# EAGLE schematic anemometer (EAGLE 6.4)
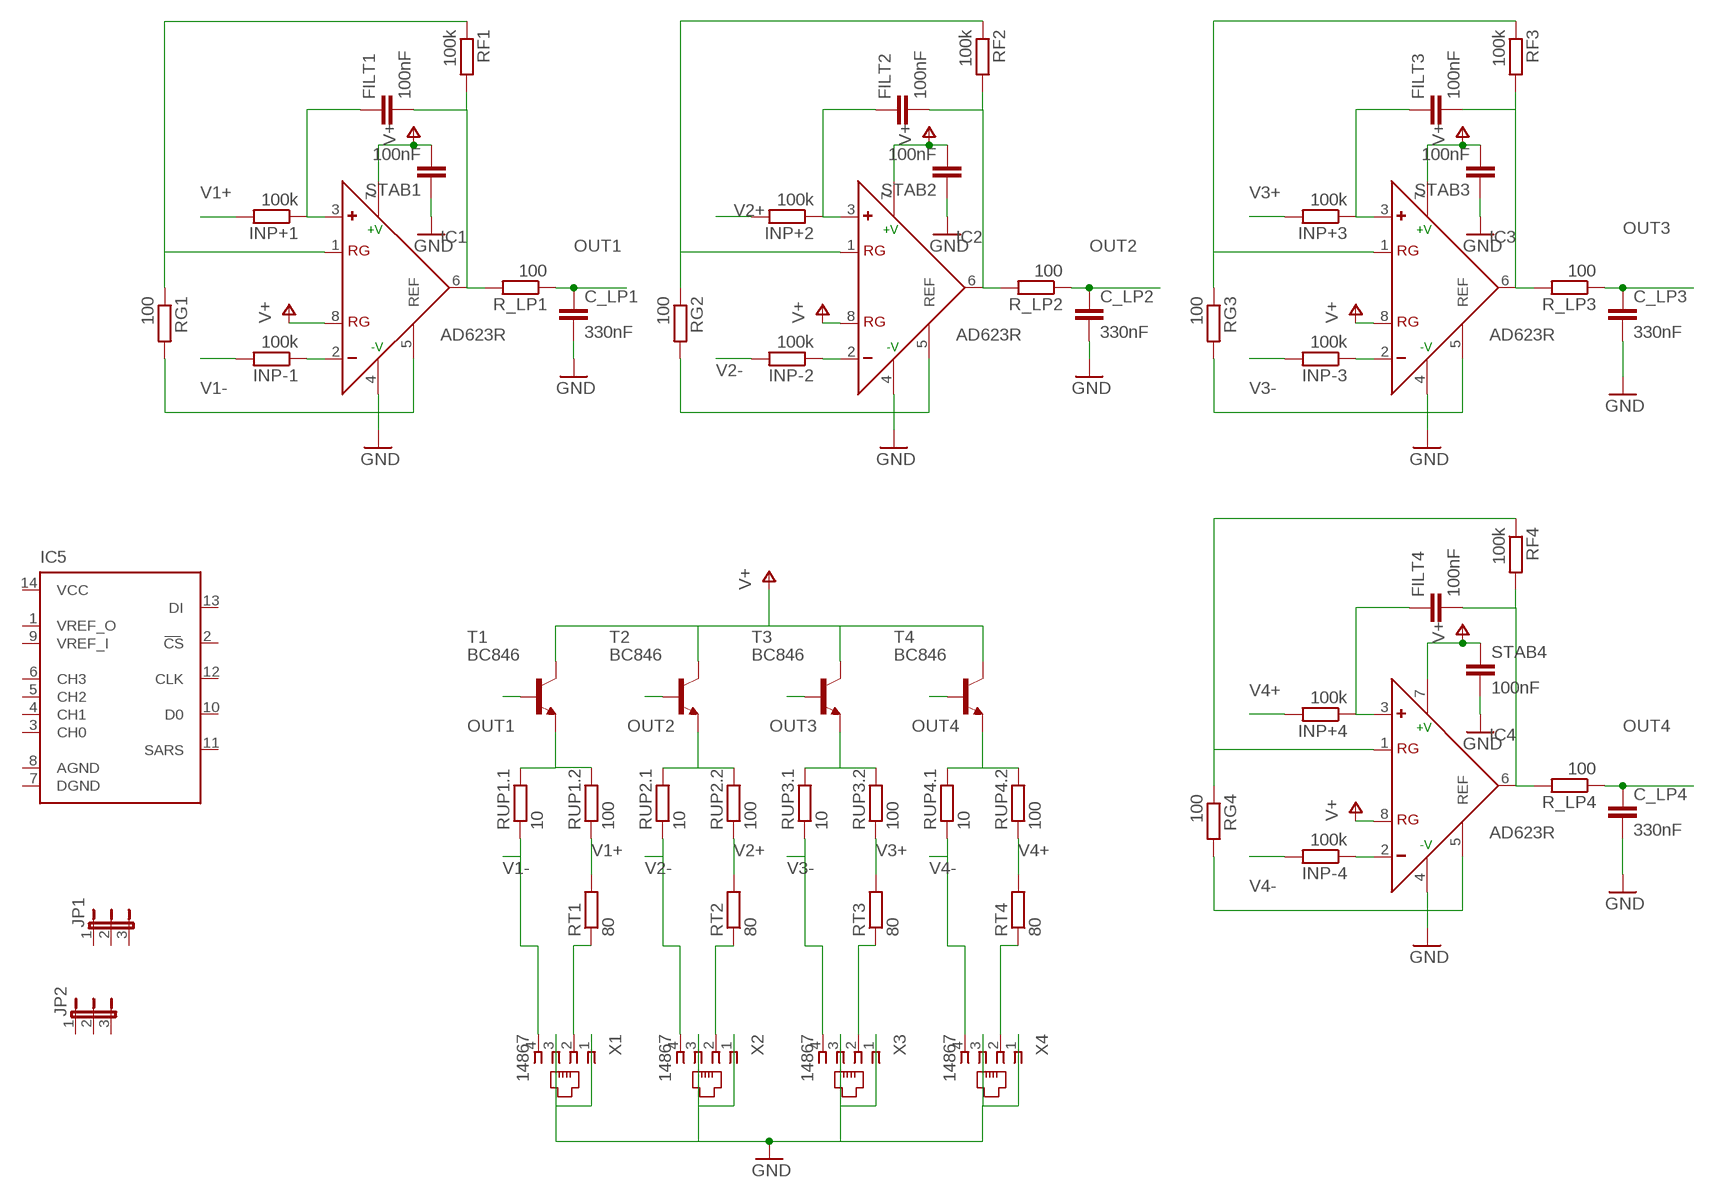
[diagram p0: schematic, sheet 1]

## Parts
C_LP1  330nF  C-EUC1206  [C1206]
C_LP2  330nF  C-EUC1206  [C1206]
C_LP3  330nF  C-EUC1206  [C1206]
C_LP4  330nF  C-EUC1206  [C1206]
FILT1  100nF  C-EUC1206  [C1206]
FILT2  100nF  C-EUC1206  [C1206]
FILT3  100nF  C-EUC1206  [C1206]
FILT4  100nF  C-EUC1206  [C1206]
IC1  AD623R  [SO8]
IC2  AD623R  [SO8]
IC3  AD623R  [SO8]
IC4  AD623R  [SO8]
IC5  ADC08034D  [SO14]
INP+1  100k  R-EU_M1206  [M1206]
INP+2  100k  R-EU_M1206  [M1206]
INP+3  100k  R-EU_M1206  [M1206]
INP+4  100k  R-EU_M1206  [M1206]
INP-1  100k  R-EU_M1206  [M1206]
INP-2  100k  R-EU_M1206  [M1206]
INP-3  100k  R-EU_M1206  [M1206]
INP-4  100k  R-EU_M1206  [M1206]
JP1  JP2E  [JP2]
JP2  JP2E  [JP2]
R_LP1  100  R-EU_M1206  [M1206]
R_LP2  100  R-EU_M1206  [M1206]
R_LP3  100  R-EU_M1206  [M1206]
R_LP4  100  R-EU_M1206  [M1206]
RF1  100k  R-EU_M1206  [M1206]
RF2  100k  R-EU_M1206  [M1206]
RF3  100k  R-EU_M1206  [M1206]
RF4  100k  R-EU_M1206  [M1206]
RG1  100  R-EU_M1206  [M1206]
RG2  100  R-EU_M1206  [M1206]
RG3  100  R-EU_M1206  [M1206]
RG4  100  R-EU_M1206  [M1206]
RT1  80  R-EU_R1206  [R1206]
RT2  80  R-EU_R1206  [R1206]
RT3  80  R-EU_R1206  [R1206]
RT4  80  R-EU_R1206  [R1206]
RUP1.1  10  R-EU_R1206  [R1206]
RUP1.2  100  R-EU_R1206  [R1206]
RUP2.1  10  R-EU_R1206  [R1206]
RUP2.2  100  R-EU_R1206  [R1206]
RUP3.1  10  R-EU_R1206  [R1206]
RUP3.2  100  R-EU_R1206  [R1206]
RUP4.1  10  R-EU_R1206  [R1206]
RUP4.2  100  R-EU_R1206  [R1206]
STAB1  100nF  C-EUC1206  [C1206]
STAB2  100nF  C-EUC1206  [C1206]
STAB3  100nF  C-EUC1206  [C1206]
STAB4  100nF  C-EUC1206  [C1206]
T1  BC846  [SOT23]
T2  BC846  [SOT23]
T3  BC846  [SOT23]
T4  BC846  [SOT23]
X1  14867  [14867]
X2  14867  [14867]
X3  14867  [14867]
X4  14867  [14867]

## Nets
GND: C_LP1.2 C_LP2.2 C_LP3.2 C_LP4.2 IC1.4(-V) IC1.5(REF) IC2.4(-V) IC2.5(REF) IC3.4(-V) IC3.5(REF) IC4.4(-V) IC4.5(REF) RG1.2 RG2.2 RG3.2 RG4.2 STAB1.1 STAB2.1 STAB3.1 STAB4.2 X1.1 X1.3 X2.1 X2.3 X3.1 X3.3 X4.1 X4.3
N$3: IC1.1(RG) RF1.1 RG1.1
N$4: IC4.1(RG) RF4.1 RG4.1
N$7: IC2.1(RG) RF2.1 RG2.1
N$9: IC3.1(RG) RF3.1 RG3.1
N$14: IC2.2(-) INP-2.1
N$19: IC1.2(-) INP-1.1
N$21: FILT2.1 IC2.3(+) INP+2.1
N$22: FILT3.1 IC3.3(+) INP+3.1
N$23: IC3.2(-) INP-3.1
N$24: FILT4.1 IC4.3(+) INP+4.1
N$25: IC4.2(-) INP-4.1
N$37: FILT1.1 IC1.3(+) INP+1.1
OUT1: C_LP1.1 R_LP1.1 T1.1(B)
OUT1.1: FILT1.2 IC1.6(OUT) R_LP1.2 RF1.2
OUT2: C_LP2.1 R_LP2.1 T2.1(B)
OUT2.1: FILT2.2 IC2.6(OUT) R_LP2.2 RF2.2
OUT3: C_LP3.1 R_LP3.1 T3.1(B)
OUT3.1: FILT3.2 IC3.6(OUT) R_LP3.2 RF3.2
OUT4: C_LP4.1 R_LP4.1 T4.1(B)
OUT4.1: FILT4.2 IC4.6(OUT) R_LP4.2 RF4.2
REF1: RT1.1 X1.2
REF2: RT2.1 X2.2
REF3: RT3.1 X3.2
REF4: RT4.1 X4.2
SUPL1: RUP1.1.2 RUP1.2.2 T1.2(E)
SUPL2: RUP2.1.2 RUP2.2.2 T2.2(E)
SUPL3: RUP3.1.2 RUP3.2.2 T3.2(E)
SUPL4: RUP4.1.2 RUP4.2.2 T4.2(E)
V1+: INP+1.2 RT1.2 RUP1.2.1
V1-: INP-1.2 RUP1.1.1 X1.4
V2+: INP+2.2 RT2.2 RUP2.2.1
V2-: INP-2.2 RUP2.1.1 X2.4
V3+: INP+3.2 RT3.2 RUP3.2.1
V3-: INP-3.2 RUP3.1.1 X3.4
V4+: INP+4.2 RT4.2 RUP4.2.1
V4-: INP-4.2 RUP4.1.1 X4.4
V+: IC1.7(+V) IC1.8(RG) IC2.7(+V) IC2.8(RG) IC3.7(+V) IC3.8(RG) IC4.7(+V) IC4.8(RG) STAB1.2 STAB2.2 STAB3.2 STAB4.1 T1.3(C) T2.3(C) T3.3(C) T4.3(C)
Unconnected: IC5.1(VREF_O) IC5.2(CS) IC5.3(CH0) IC5.4(CH1) IC5.5(CH2) IC5.6(CH3) IC5.9(VREF_I) IC5.10(D0) IC5.11(SARS) IC5.12(CLK) IC5.13(DI) JP1.1 JP1.2 JP1.3 JP2.1 JP2.2 JP2.3

## Power pins joined to a net without a drawn wire
AGND: IC5.8(AGND)
DGND: IC5.7(DGND)
VCC: IC5.14(VCC)

## Library data of the parts
C_LP1-C_LP4 FILT1-FILT4 STAB1-STAB4 = rcl:C-EU: CAPACITOR, European symbol
IC1-IC4 = analog-devices:AD623: Single-Supply, Rail-to-Rail, Low Cost Instrumentation Amplifier Source: http://www.analog.com/static/imported-files/data_sheets/AD623.pdf; MPN: AD623ARZ.; OC_FARNELL: 9426213; OC_NEWARK: 31M4186
IC5 = linear:ADC08034: A/D CONVERTER
INP+1-INP+4 INP-1-INP-4 R_LP1-R_LP4 RF1-RF4 RG1-RG4 RT1-RT4 RUP1.1 RUP1.2 RUP2.1 RUP2.2 RUP3.1 RUP3.2 RUP4.1 RUP4.2 = resistor:R-EU_: RESISTOR, European symbol
JP1 JP2 = jumper:JP2E: JUMPER
T1-T4 = transistor:BC846: NPN TRANSISTOR
X1-X4 = con-4ucon:14867: RJ11 Connector Source: 4UCON TECHNOLOGY INC. 14867.pdf; OC_FARNELL: unknown; OC_NEWARK: unknown